# EAGLE design stim_rev_I_RECT (EAGLE 7.6.0)
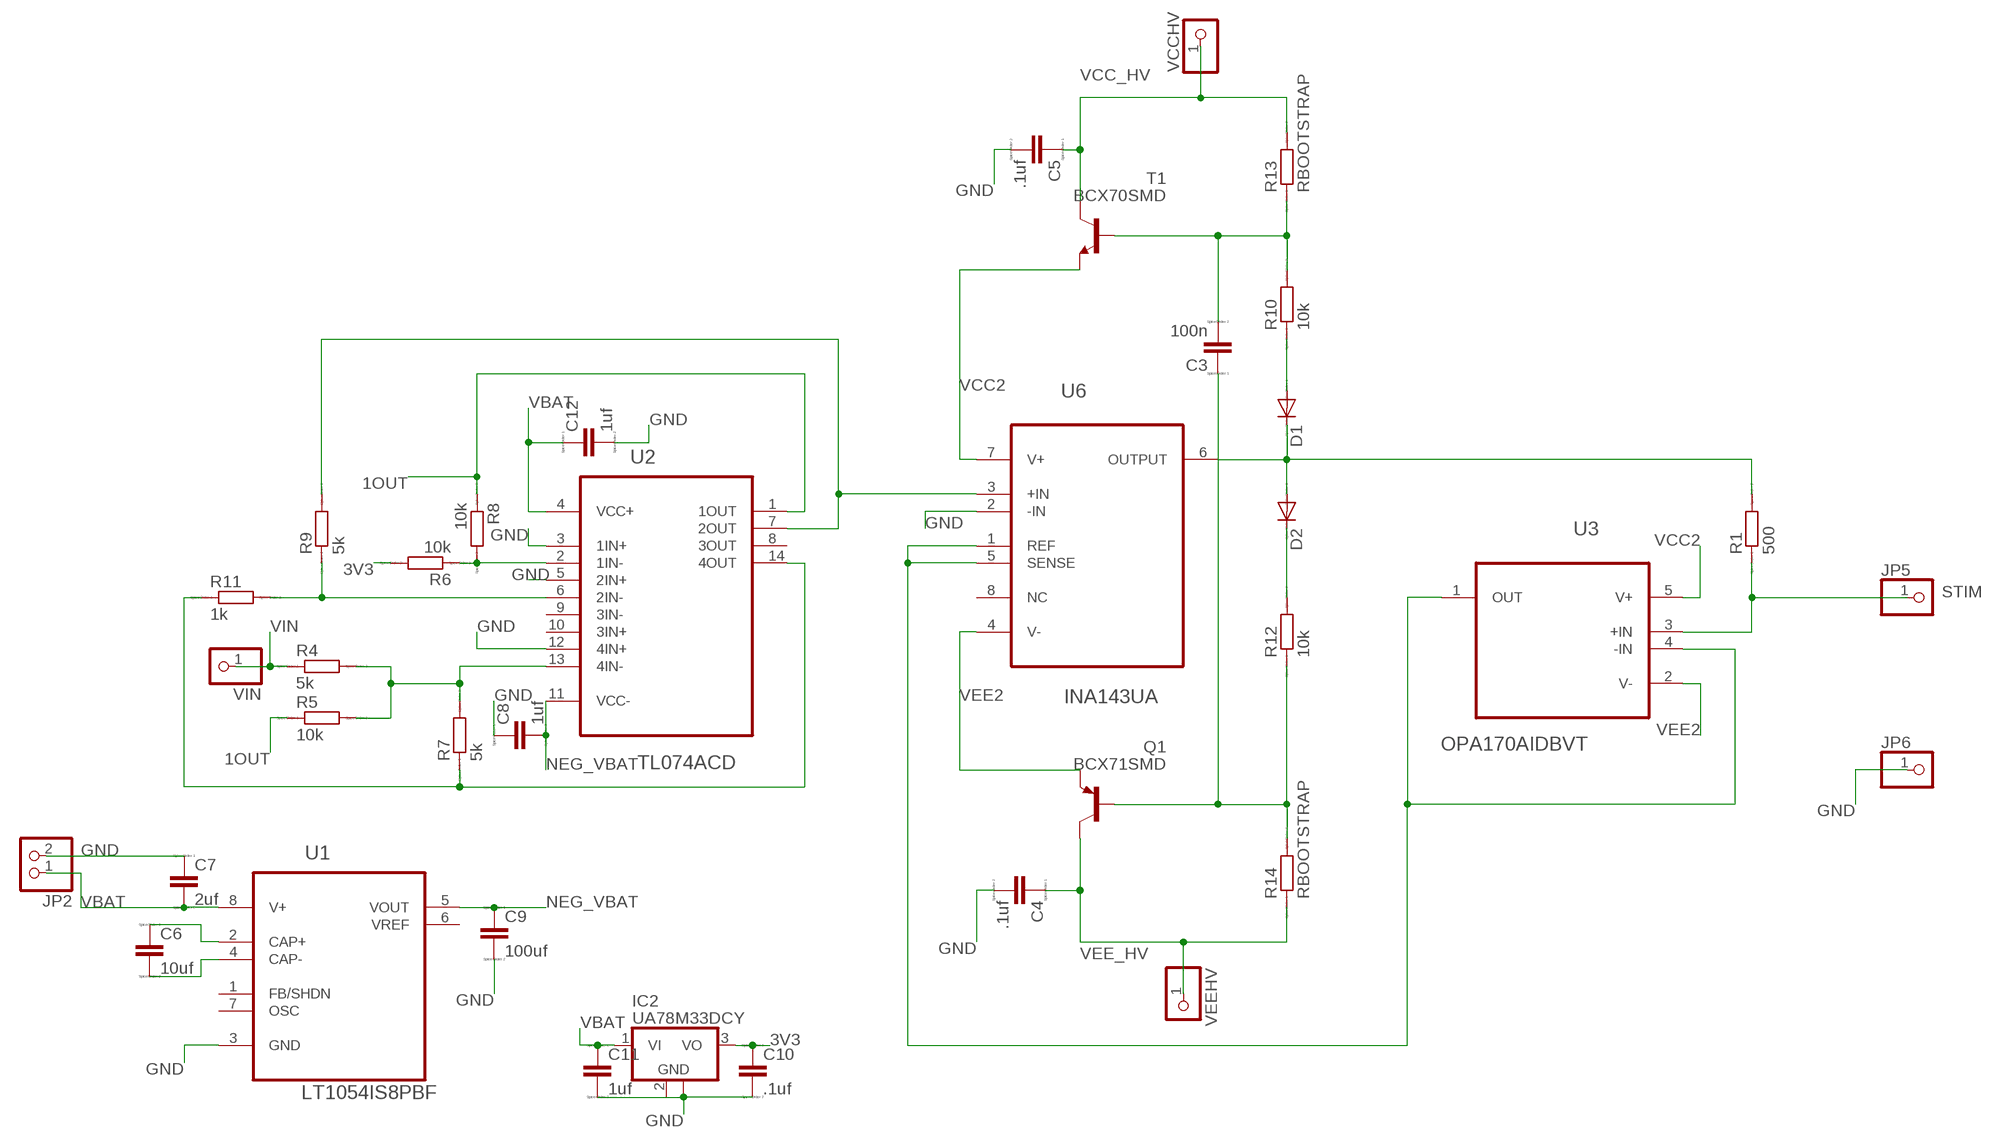
[diagram p0: schematic, sheet 1]

## Parts
C3  100n  CC0603  [C0603]
C4  .1uf  CC0603  [C0603]
C5  .1uf  CC0603  [C0603]
C6  10uf  CC0603  [C0603]
C7  2uf  CC0603  [C0603]
C8  1uf  CC0603  [C0603]
C9  100uf  CC1210  [C1210]
C10  .1uf  CC0402  [C0402]
C11  1uf  CC0603  [C0603]
C12  1uf  CC0603  [C0603]
D1  DIODE-DO214AA  [DO214AA]
D2  DIODE-DO214AA  [DO214AA]
IC2  UA78M33DCY  [SOT223]
JP2  PINHD-1X2  [1X02]
JP5  PINHD-1X1  [1X01]
JP6  PINHD-1X1  [1X01]
Q1  BCX71SMD  [SOT23]
R1  500  RR0603  [R0603]
R4  5k  RR0402  [R0402]
R5  10k  RR0402  [R0402]
R6  10k  RR0402  [R0402]
R7  5k  RR0402  [R0402]
R8  10k  RR0402  [R0402]
R9  5k  RR0402  [R0402]
R10  10k  RR0603  [R0603]
R11  1k  RR0402  [R0402]
R12  10k  RR0603  [R0603]
R13  RBOOTSTRAP  RR0603  [R0603]
R14  RBOOTSTRAP  RR0603  [R0603]
T1  BCX70SMD  [SOT23]
U1  LT1054IS8PBF  [SOIC127P600X175-8N]
U2  TL074ACD  [SOIC127P600X175-14N]
U3  OPA170AIDBVT  [SOT95P280X145-5N]
U6  INA143UA  [SOIC127P600X175-8N]
VCCHV  PINHD-1X1  [1X01]
VEEHV  PINHD-1X1  [1X01]
VIN  PINHD-1X1  [1X01]

## Nets
1OUT: R5.1 R8.1 U2.1(1OUT)
3V3: C10.1 IC2.3(VO) R6.2
4OUT: R7.1 R11.1 U2.14(4OUT)
GND: C4.2 C5.2 C7.1 C8.1 C9.2 C10.2 C11.2 C12.2 IC2.2(GND) IC2.4(GND) JP2.2 JP6.1 U1.3(GND) U2.3(1IN+) U2.5(2IN+) U2.12(4IN+) U6.2(-IN)
N$2: D1.C D2.A R1.2 U6.6(OUTPUT)
N$3: C3.1 Q1.1(B) R12.1 R14.2
N$4: D2.C R12.2
N$6: D1.A R10.1
N$7: C3.2 R10.2 R13.1 T1.1(B)
N$9: C6.2 U1.4(CAP-)
N$10: C6.1 U1.2(CAP+)
N$11: R6.1 R8.2 U2.2(1IN-)
N$13: R9.1 R11.2 U2.6(2IN-)
N$14: U3.1(OUT) U3.4(-IN) U6.1(REF) U6.5(SENSE)
N$17: R4.2 R5.2 R7.2 U2.13(4IN-)
NEG_VBAT: C8.2 C9.1 U1.5(VOUT) U2.11(VCC-)
STIM: JP5.1 R1.1 U3.3(+IN)
VBAT: C7.2 C11.1 C12.1 IC2.1(VI) JP2.1 U1.8(V+) U2.4(VCC+)
VCC2: T1.2(E) U3.5(V+) U6.7(V+)
VCC_HV: C5.1 R13.2 T1.3(C) VCCHV.1
VCCS_IN: R9.2 U2.7(2OUT) U6.3(+IN)
VEE2: Q1.2(E) U3.2(V-) U6.4(V-)
VEE_HV: C4.1 Q1.3(C) R14.1 VEEHV.1
VIN: R4.1 VIN.1
Unconnected: U1.1(FB/SHDN) U1.6(VREF) U1.7(OSC) U2.8(3OUT) U2.9(3IN-) U2.10(3IN+) U6.8(NC)

## Library data of the parts
C3-C12 = eagle-ltspice:C: CAPACITOR, European symbol; SPICEMODEL: NONE; SPICEPREFIX: C
D1 D2 = diode:DIODE-: DIODE
IC2 = linear:UA78M*: POSITIVE-VOLTAGE REGULATORS Source: http://focus.ti.com/lit/ds/symlink/ua78m33.pdf
JP2 = pinhead:PINHD-1X2: PIN HEADER
JP5 JP6 VCCHV VEEHV VIN = pinhead:PINHD-1X1: PIN HEADER
Q1 = transistor-pnp:BCX71SMD: PNP Transistor
R1 R4-R14 = eagle-ltspice:R: RESISTOR, European symbol; SPICEMODEL: NONE; SPICEPREFIX: R
T1 = transistor:BCX70SMD: NPN TRANSISTOR
U1 = LTC_By_element14_Batch_1:LT1054IS8PBF: Switched-Capacitor Voltage Converter with Regulator; MPN: LT1054IS8#PBF; OC_FARNELL: 1663341; OC_NEWARK: 57M1198; PACKAGE: SOIC-8; SUPPLIER: Linear Technology
U2 = Texas Instruments_By_element14_Batch_1:TL074ACD: LOW-NOISE JFET-INPUT OPERATIONAL AMPLIFIERS; MPN: TL074ACD; OC_FARNELL: 9593349; OC_NEWARK: 52F2748; PACKAGE: SOIC-14; SUPPLIER: Texas Instruments
U3 = Texas Instruments_By_element14_Batch_1:OPA170AIDBVT: OPERATIONAL AMPLIFIERS; MPN: OPA170AIDBVT; OC_FARNELL: 2057089; OC_NEWARK: 64T3747; PACKAGE: SOT-23-5; SUPPLIER: Texas Instruments
U6 = Texas Instruments_By_element14_Batch_1:INA143UA: DIFFERENCE AMPLIFIERS; MPN: INA143UA; OC_FARNELL: 1097461; OC_NEWARK: 35C0497; PACKAGE: SOIC-8; SUPPLIER: Texas Instruments

## Board
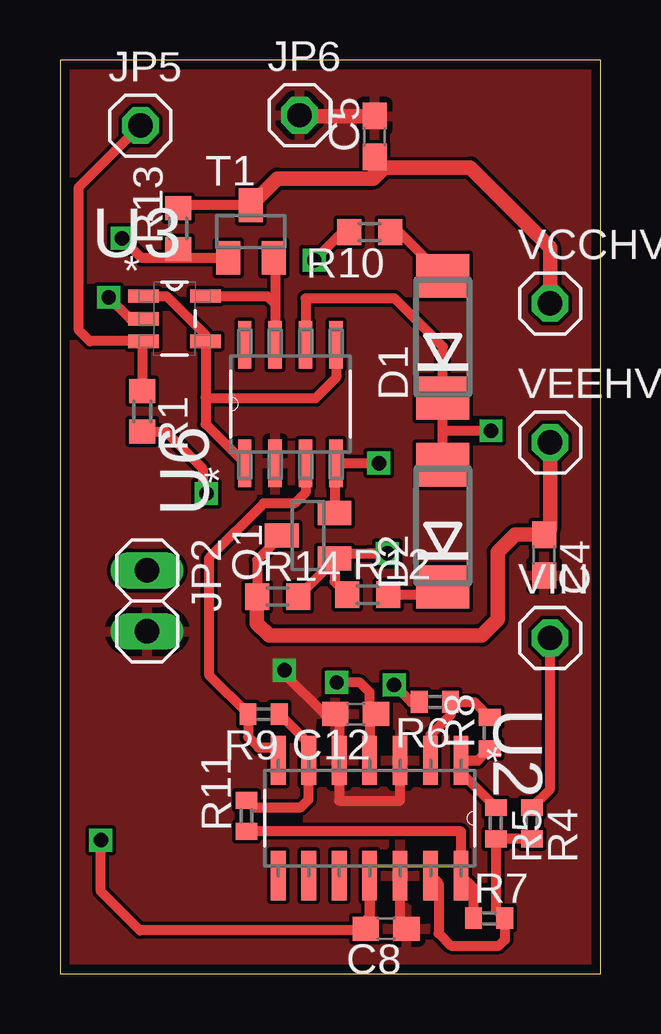
[diagram p1: board, top side]
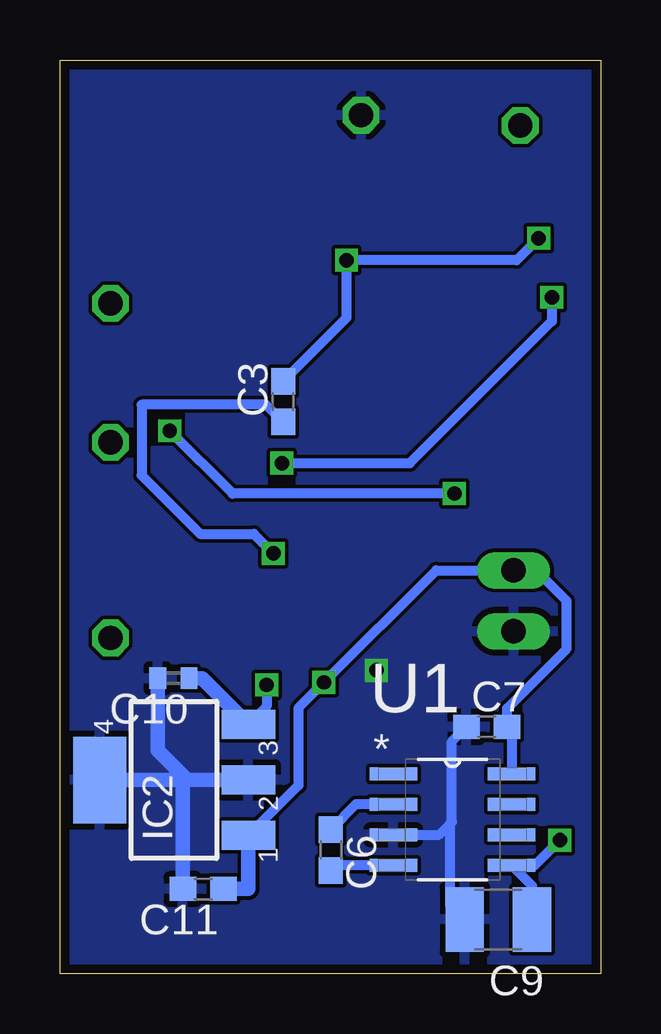
[diagram p2: board, bottom side, seen from below]

Size 22.53 x 38.09 mm. Coordinates in mm from the lower left corner, seen from the top.
Outline: 0,0 22.53,0 22.53,38.09 0,38.09 0,0
Copper layers (1*16): Top 0.0356mm / dielectric 1.5011mm / Bottom 0.0356mm
Design rules "LaenPCBOrder": minimum track width 6mil, minimum drill 13mil, track to track 6mil, track to pad 6mil, pad to pad 6mil, via to via 6mil, smd to smd 6mil, copper to edge 15mil, drill to drill 6mil, minimum pad ring 7mil, minimum via ring 7mil, stop-mask expansion 3mil, vias tented up to drill 0mil, thermal gap 10mil

### Footprints (pad centres in the part's own frame; a part is rotated, then mirrored left to right if it is on the bottom)
C0603 = smd 1.1 x 1: 1 -0.85,0; 2 0.85,0
C1210 = smd 1.6 x 2.7: 1 -1.4,0; 2 1.4,0
C0402 = smd 0.7 x 0.9: 1 -0.65,0; 2 0.65,0
DO214AA = smd 1.8 x 2.2: A 2.55,0; C -2.55,0
SOT223 = smd 1.219 x 2.235: 1 -2.311,-3.099; 2 0,-3.099; 3 2.311,-3.099 | smd 3.6 x 2.2: 4 0,3.099
1X02 = drill 1.016 long: 1 -1.27,0; 2 1.27,0
1X01 = drill 1.016 octagon: 1 0,0
SOT23 = smd 1 x 1.4: 1 -0.95,-1.1; 2 0.95,-1.1; 3 0,1.1
R0603 = smd 1 x 1.1: 1 -0.85,0; 2 0.85,0
R0402 = smd 0.7 x 0.9: 1 -0.65,0; 2 0.65,0
SOIC127P600X175-8N = smd 1.981 x 0.533: 1 -2.464,1.905; 2 -2.464,0.635; 3 -2.464,-0.635; 4 -2.464,-1.905; 5 2.464,-1.905; 6 2.464,-0.635; 7 2.464,0.635; 8 2.464,1.905
SOIC127P600X175-14N = smd 2.057 x 0.61: 1 -4.801,7.62; 2 -4.801,6.35; 3 -4.801,5.08; 4 -4.801,3.81; 5 -4.801,2.54; 6 -4.801,1.27; 7 -4.801,0; 8 0,0; 9 0,1.27; 10 0,2.54; 11 0,3.81; 12 0,5.08; 13 0,6.35; 14 0,7.62
SOT95P280X145-5N = smd 1.27 x 0.559: 1 -1.295,0.94; 2 -1.295,0; 3 -1.295,-0.94; 4 1.295,-0.94; 5 1.295,0.94
SOIC127P600X175-8N' = smd 1.981 x 0.559: 1 -2.464,1.905; 2 -2.464,0.635; 3 -2.464,-0.635; 4 -2.464,-1.905; 5 2.464,-1.905; 6 2.464,-0.635; 7 2.464,0.635; 8 2.464,1.905

### Placement (x,y rotation side)
C3  13.23,23.85 90 bottom
C4  20.17,17.45 270 top
C5  13.11,34.9 90 top
C6  11.25,5.16 270 bottom
C7  4.75,10.29 0 bottom
C8  13.59,1.88 180 top
C9  4.27,2.26 180 bottom
C10  17.81,12.32 180 bottom
C11  16.56,3.53 180 bottom
C12  12.32,10.82 180 top
D1  15.95,26.54 90 top
D2  15.95,18.67 90 top
IC2  17.78,8.08 90 bottom
JP2  3.63,15.54 270 top
JP5  3.35,35.36 0 top
JP6  9.98,35.79 0 top
Q1  10.34,18.26 90 top
R1  3.43,23.44 270 top
R4  19.66,6.27 270 top
R5  18.16,6.27 270 top
R6  15.62,11.33 180 top
R7  17.88,2.31 0 top
R8  17.91,10.03 90 top
R9  8.48,10.82 180 top
R10  12.9,30.91 180 top
R11  7.77,6.58 90 top
R12  12.83,15.8 0 top
R13  4.93,31.06 90 top
R14  9.07,15.72 0 top
T1  7.95,30.94 0 top
U1  6.17,6.43 0 bottom
U2  9.09,4.09 270 top
U3  4.78,27.3 0 top
U6  INA143UA  [SOIC127P600X175-8N']  9.6,23.75 90 top
VCCHV  20.42,27.94 0 top
VEEHV  20.42,22.15 0 top
VIN  20.42,14 0 top

### Tracks (layer width: path | path; a pad name or v marks a point on that pad's centre or on a via)
1OUT
  Top 0.406: R5.1 16.71,8.37 U2.1 17.41,8.89 R8.1
3V3  (via drill 0.6)
  Top 0.406: R6.2 14.63,11.33 v13.92,12.04
  Bottom 0.406: v13.92,12.04 13.92,11.15 IC2.3
  Bottom 0.61: C10.1 16.61,12.32 IC2.3
4OUT
  Top 0.406: R11.1 16.71,5.93 U2.14 17.23,3.57 R7.1
GND  (via drill 0.6)
  Top 0.406: U2.3 14.17,7.21 11.63,7.21 U2.5 11.63,10.66 C12.2 11.02,10.82 9.35,12.5 v9.35,12.65 | C8.1 14.17,2.15 U2.12
  Top 0.61: C5.2 10.02,35.75 JP6.1
  Bottom 0.406: U1.3 6.73,5.79 6.27,6.25 | 6.27,6.25 6.2,6.33 6.2,9.69 C7.1 | C9.2 6.27,2.87 6.27,6.25
  Bottom 0.61: IC2.2 17.22,8.08 | 17.22,8.08 17.41,8.08 | 17.41,8.08 IC2.4 | C11.2 17.41,8.08 | C10.2 18.45,9.31 17.22,8.08
  pour Top: 0,0 22.53,0 22.53,38.1 0,38.1
  pour Bottom: 0,0 22.53,0 22.53,38.1 0,38.1
N$2  (via drill 0.6)
  Top 0.406: D2.A 15.95,22.66 | 15.95,22.66 D1.C 15.95,26.14 13.95,28.14 10.24,28.14 U6.6 | R1.2 4.41,22.59 5.94,21.06 5.94,20.17 v6.1,20.02 | v17.96,22.63 15.98,22.63 15.95,22.66
  Bottom 0.406: v6.1,20.02 15.34,20.02 v17.96,22.63
N$3  (via drill 0.6)
  Top 0.406: 11.44,17.24 Q1.1 11.65,17.53 v13.64,17.53 12.85,17.53 | 11.44,17.24 R14.2 | 11.44,17.24 11.44,16.34 R12.1
  Bottom 0.406: C3.1 13.96,23.72 19.13,23.72 19.13,20.78 16.69,18.34 14.45,18.34 v13.64,17.53
N$4
  Top 0.406: R12.2 15.63,15.8 D2.C
N$6
  Top 0.406: D1.A 14.13,30.91 R10.1
N$7  (via drill 0.6)
  Top 0.406: R13.1 5.3,29.84 T1.1 3.41,29.84 v2.59,30.66 | v10.59,29.74 11.76,30.91 R10.2
  Bottom 0.406: v2.59,30.66 3.5,29.74 v10.59,29.74 10.59,27.34 C3.2
N$9
  Bottom 0.406: U1.4 11.04,4.52 C6.2
N$10
  Bottom 0.406: U1.2 10.2,7.06 C6.1
N$11
  Top 0.406: R8.2 17.26,11.33 R6.1 16.27,10.79 15.44,9.96 U2.2
N$13
  Top 0.406: R11.2 8.07,6.93 10.03,6.93 10.36,7.26 U2.6 10.36,9.59 R9.1
N$14
  Top 0.406: 7.64,21.23 U6.1 6.07,22.91 6.07,24.03 | 6.07,24.03 U3.4 6.07,26.62 4.45,28.25 U3.1 | U6.5 11.51,24.84 10.64,23.98 6.12,23.98 6.07,24.03
N$17
  Top 0.406: U2.13 15.77,3.76 15.77,1.68 16.28,1.17 18.29,1.17 18.53,1.41 R7.2 18.16,2.68 R5.2 R4.2
NEG_VBAT  (via drill 0.6)
  Top 0.406: C8.2 12.9,2.04 U2.11 12.9,2.39 12.32,1.8 3.32,1.8 1.7,3.43 v1.7,5.56
  Bottom 0.406: C9.1 2.87,3.68 U1.5 2.74,4.52 v1.7,5.56
STIM
  Top 0.406: R1.1 3.43,26.31 U3.3 1.25,26.36 0.79,26.82 0.79,32.79 JP5.1
VBAT  (via drill 0.6)
  Top 0.406: C12.1 12.9,10.55 | 12.9,10.55 U2.4 | 12.9,10.55 12.9,11.73 12.5,12.14 v11.53,12.14
  Bottom 0.406: U1.8 3.71,10.1 C7.2 3.9,11.06 1.42,13.54 1.42,15.54 2.69,16.82 3.12,16.82 JP2.1 6.86,16.82 v11.53,12.14 12.6,11.07 12.6,7.85 IC2.1
  Bottom 0.61: IC2.1 14.68,3.53 C11.1
VCC2
  Top 0.406: T1.2 8.97,29.45 8.97,27.91 | 8.97,27.91 U6.7 | U3.5 8.64,28.25 8.97,27.91
VCC_HV
  Top 0.406: T1.3 5.05,32.04 R13.2
  Top 0.61: T1.3 9.06,33.15 13.06,33.15 13.11,33.2 | C5.1 13.11,33.2 | 13.11,33.2 13.51,33.6 17.09,33.6 20.42,30.28 VCCHV.1
VCCS_IN
  Top 0.406: U6.3 10.24,20.07 9.78,19.61 8.48,19.61 6.22,17.35 6.22,12.43 R9.2 7.83,9.87 8.28,9.42 9.07,9.42 9.09,9.4 | U2.7 9.09,9.4 | 9.09,9.4 9.09,9.56
VEE2  (via drill 0.6)
  Top 0.406: Q1.2 11.44,21.22 U6.4 v13.28,21.29 | U3.2 2.92,27.3 v2.03,28.19
  Bottom 0.406: v13.28,21.29 7.95,21.29 2.03,27.2 v2.03,28.19
VEE_HV
  Top 0.406: Q1.3 8.22,17.24 R14.1
  Top 0.61: VEEHV.1 20.42,18.55 C4.1 18.96,18.3 18.24,17.58 18.24,14.76 17.58,14.1 8.71,14.1 8.2,14.61 8.2,15.71 R14.1
VIN
  Top 0.406: R4.1 20.42,7.69 VIN.1